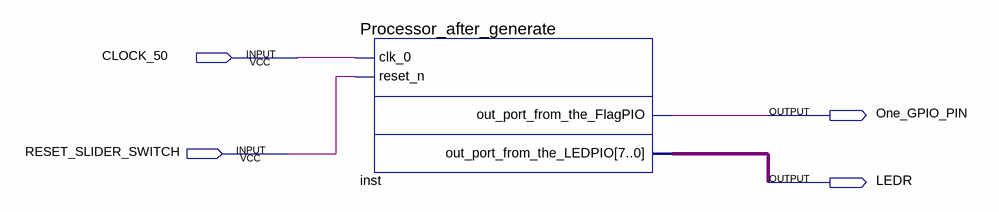
[diagram p0: schematic sheet]
// Quartus schematic zmc_lab2.bdf as structural Verilog: 1 symbols, 4 pins
module zmc_lab2 (
  input  CLOCK_50,
  input  RESET_SLIDER_SWITCH,
  output One_GPIO_PIN,
  output LEDR
);

  wire [7:0] inst_out_port_from_the_ledpio;

  Processor_after_generate inst (
    .clk_0(CLOCK_50), .reset_n(RESET_SLIDER_SWITCH), .out_port_from_the_FlagPIO(One_GPIO_PIN),
    .out_port_from_the_LEDPIO(inst_out_port_from_the_ledpio));
endmodule
